# Altium project test.PrjPcb
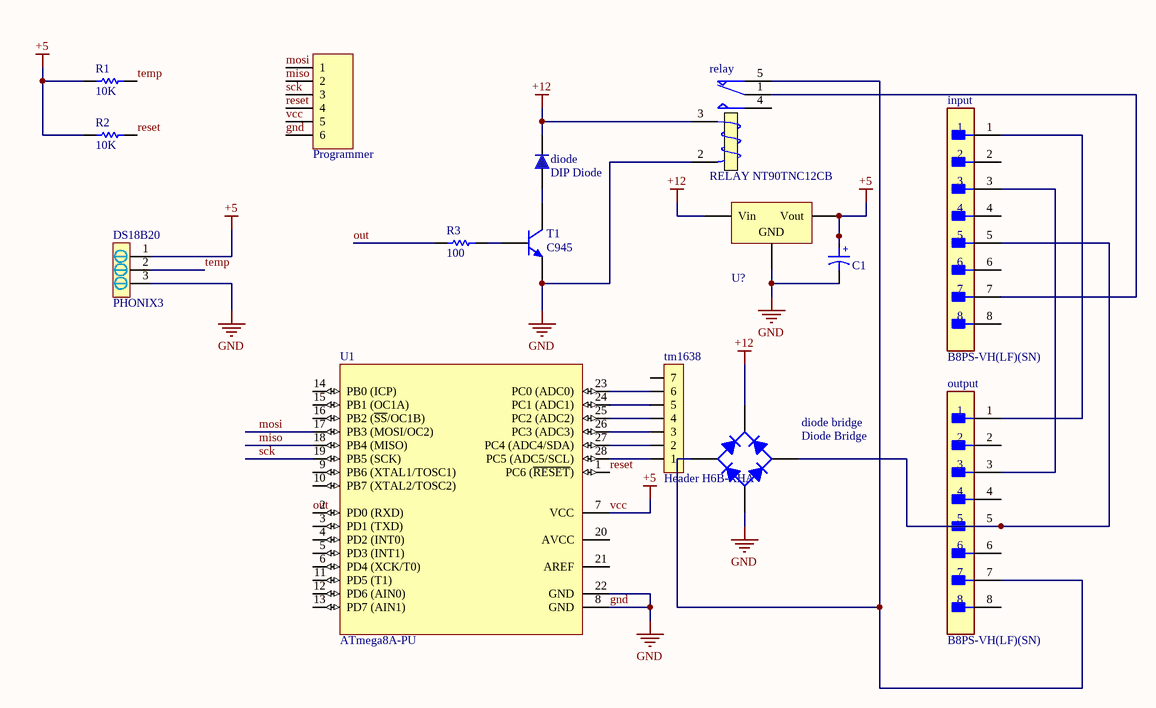
[diagram p0: Sheet1.SchDoc]
1 sheet, 15 parts. Net scope: global (net labels, ports and power ports of the same name join across sheets).
Board file: PCB1.PcbDoc

## Sheet Sheet1.SchDoc
size A4; SheetNumber: 1; SheetTotal: 1

### Parts
C1  Cap 18x26  [Cap electrolitic radial 18x26]  (value not drawn)
diode  DIP Diode  [Diode 1n4007]
diode_bridge  Diode Bridge  [Bridge KBJ PACKAGE]
DS18B20  PHONIX3  [PHONIX3]
input  B8PS-VH(LF)(SN)  [FP-B8PS-VH_LF_SN-MFG]
output  B8PS-VH(LF)(SN)  [FP-B8PS-VH_LF_SN-MFG]
Programmer  Header 6  [HDR1X6]  (value not drawn)
R1  10K  [Axial 0_5W 5_0mm]
R2  10K  [Axial 0_5W 5_0mm]
R3  100  [Axial 0_5W 5_0mm]
relay  RELAY NT90TNC12CB  [RELAY NT90TNC12CB]
T1  C945  [c945]
tm1638  Header H6B-XHA  [Header H7B-XHA]
U1  ATmega8A-PU  [28P3]
U?  L7805CV  [TO-220 AB WITH HEAT SINK]  (value not drawn)

### Nets
+12: diode.2 diode_bridge.1(+) relay.3(T1) U?.1(Vin)
gnd: C1.2 diode_bridge.4(-) DS18B20.3 Programmer.6 relay.2(T2) T1.2(E) U1.8(GND) U1.22(GND) U?.2(GND)
vcc: C1.1 DS18B20.1 Programmer.5 R1.1 R2.2 U1.7(VCC) U?.3(Vout)  [also labelled +5]
miso: Programmer.2 U1.18(PB4_(MISO))
mosi: Programmer.1 U1.17(PB3_(MOSI/OC2))
out: R3.1 U1.2(PD0_(RXD))
reset: Programmer.4 R2.1 U1.1(PC6_(~{RESET}))
sck: Programmer.3 U1.19(PB5_(SCK))
temp: DS18B20.2 R1.2
Netdiode_1: diode.1 T1.3(C)
Netdiode_bridge_2: diode_bridge.2(AC) output.7 relay.5(NC)
Netdiode_bridge_3: diode_bridge.3(AC) input.5 output.5
Netinput_1: input.1 output.1
Netinput_3: input.3 output.3
Netinput_7: input.7 relay.1(COM)
NetR3_2: R3.2 T1.1(B)
Nettm1638_1: tm1638.1 U1.28(PC5_(ADC5/SCL))
Nettm1638_2: tm1638.2 U1.27(PC4_(ADC4/SDA))
Nettm1638_3: tm1638.3 U1.26(PC3_(ADC3))
Nettm1638_4: tm1638.4 U1.25(PC2_(ADC2))
Nettm1638_5: tm1638.5 U1.24(PC1_(ADC1))
Nettm1638_6: tm1638.6 U1.23(PC0_(ADC0))

Not connected (* = marked no-connect by the designer): input 2 4 6 8; output 2 4 6 8; relay 4(NO); tm1638 7; U1 3(PD1_(TXD)) 4(PD2_(INT0)) 5(PD3_(INT1)) 6(PD4_(XCK/T0)) 9(PB6_(XTAL1/TOSC1)) 10(PB7_(XTAL2/TOSC2)) 11(PD5_(T1)) 12(PD6_(AIN0)) 13(PD7_(AIN1)) 14(PB0_(ICP)) 15(PB1_(OC1A)) 16(PB2_(~{SS}/OC1B)) 20(AVCC) 21(AREF)

### Notes on the sheet
- (in symbol Cap electrolitic radial 18x26) +

### Library data of the parts
C1 = Cap electrolitic radial 18x26: Cap electrolitic radial; Designer: Abbas Basereh; Value: 3300uF25V; Data: 16-12-2016
diode = Diode DIP Package: Published: 8-Jun-2000; LatestRevisionDate: 17-Jul-2002; LatestRevisionNote: Re-released for DXP Platform.; DatasheetVersion: 1997; Publisher: Altium Limited; PackageDescription: Diode, Axial; Body 3.8 x 1.9 mm (LxDia. max), Lead Dia. 0.53 mm (max); Code_JEDEC: DO-204-AH; ComponentLink1Description: Manufacturer Link; ComponentLink1URL: http://www.fairchildsemi.com/; ComponentLink2Description: Datasheet; ComponentLink2URL: http://www.fairchildsemi.com/ds/1N%2F1N4148.pdf
diode_bridge = Diode Bridge TOTAL SIZE: Full Wave Diode Bridge; Designer: Abbas Basereh; Design Date: 1395/11/09; ComponentLink1Description: Datasheet; ComponentLink2Description: Reference; Mounting Technology: Surface Mount\Through-Hole; Status: Unreleased
input output = CMP-17439-000025-1: CONN HEADER R/A 8POS 3.96MM; Pitch: 0.156inch; Connector Type: Male Pin; Voltage Rating: 250V; Number of Contacts: 8; Gender: Male; Current Rating: 10A; Contact Material: Brass; Packaging: Bulk; Color: Natural; Housing Color: Natural; Termination: Solder; Number of Rows: 1; REACH SVHC: No SVHC; Orientation: Right Angle; Mount: Through Hole; Contact Type: Male Pin; Fastening Type: Ramp; Number of Positions: 8; Series: VH; Contact Plating: Tin; Contact Mating Length: 0.303inch; Lead Free: Lead Free
Programmer = Header 6: Header, 6-Pin; LatestRevisionDate: 17-Jul-2002; LatestRevisionNote: Re-released for DXP Platform.; Publisher: Altium Limited
R1-R3 = RES Axial 0.5W: Designer: Abbas Basereh; Desc.: RES Axial 0.5W; Data: 4-1-2017
relay = RELAY NT90TNC12CB: Relay_SPDT POWER NEEDLE; Designer: Abbas Basereh; PackageDescription: 31.7x26.7x28; PackageReference: RELAY NT90TNC12CB; Mounting Technology: Through-Hole; Value: RELAY NT90TNC12CB; ComponentLink1Description: Datasheet; Pin Count: 0; Update Date: 2017-3-4; Category: NT90TNC12CB
T1 = C945: NPN Silicon Epitaxial Planar Transistor; Published: 2017-2-8; LatestRevisionDate: 2017; LatestRevisionNote: IPC-7351 Footprint Added.; DatasheetVersion: 2017; PackageVersion: 2017-2-8; PackageReference: SOT23; Publisher: Abbas Basereh; PackageDescription: 3-Pin SOT-23 Package 0.95 mm Pitch, 2.3 mm Lead Span; ComponentLink1Description: Manufacturer Link; ComponentLink1URL: http://www.taitroncomponents.com/; ComponentLink2Description: Datasheet; ComponentLink2URL: http://www.taitroncomponents.com/
tm1638 = Header H7B-XHA
U1 = ATmega8A-PU: 8-bit AVR Microcontroller, 8KB Flash, 512 Bytes EEPROM, 1KB SRAM, 28-pin PDIP, Industrial Grade (-40�C to 85�C); Published: 2017-1-5; DatasheetVersion: 2017-1-5; PackageVersion: 2017-1-5; PackageReference: 28P3; Publisher: Abbas Basereh; PackageDescription: 28-lead (0.300"/7.62mm Wide) Plastic Dual Inline Package (PDIP); Supplier 1: Digi-Key; Supplier Part Number 1: ATMEGA8A-PU-ND; Supplier 2: Farnell; Supplier Part Number 2: 1748534; Supplier 3: Mouser; Supplier Part Number 3: 556-ATMEGA8A-PU; ComponentLink1Description: Manufacturer Link; ComponentLink1URL: http://www.atmel.com/products/avr/default.asp?; ComponentLink2Description: ATmega8A Datasheet; ComponentLink2URL: http://www.atmel.com/dyn/resources/prod_documents/doc8159.pdf; ComponentLink3Description: ATmega8A Summary; ComponentLink3URL: http://www.atmel.com/dyn/resources/prod_documents/8159S.pdf; ComponentLink4Description: Atmel.com Home; ComponentLink4URL: http://www.atmel.com
U? = L7805CV-Linear Voltage Regulator IC Positive 1 Output 5V 1.5A TO-220AB: Linear Voltage Regulator IC Positive FIXED; Manufacturer: STMicroelectronics; Designer: Abbas Basereh; Link: https://www.aliexpress.com/item/; Link: http://www.tme.eu/en/; Link: http://www.digikey.com/; Part. No: L7805CV